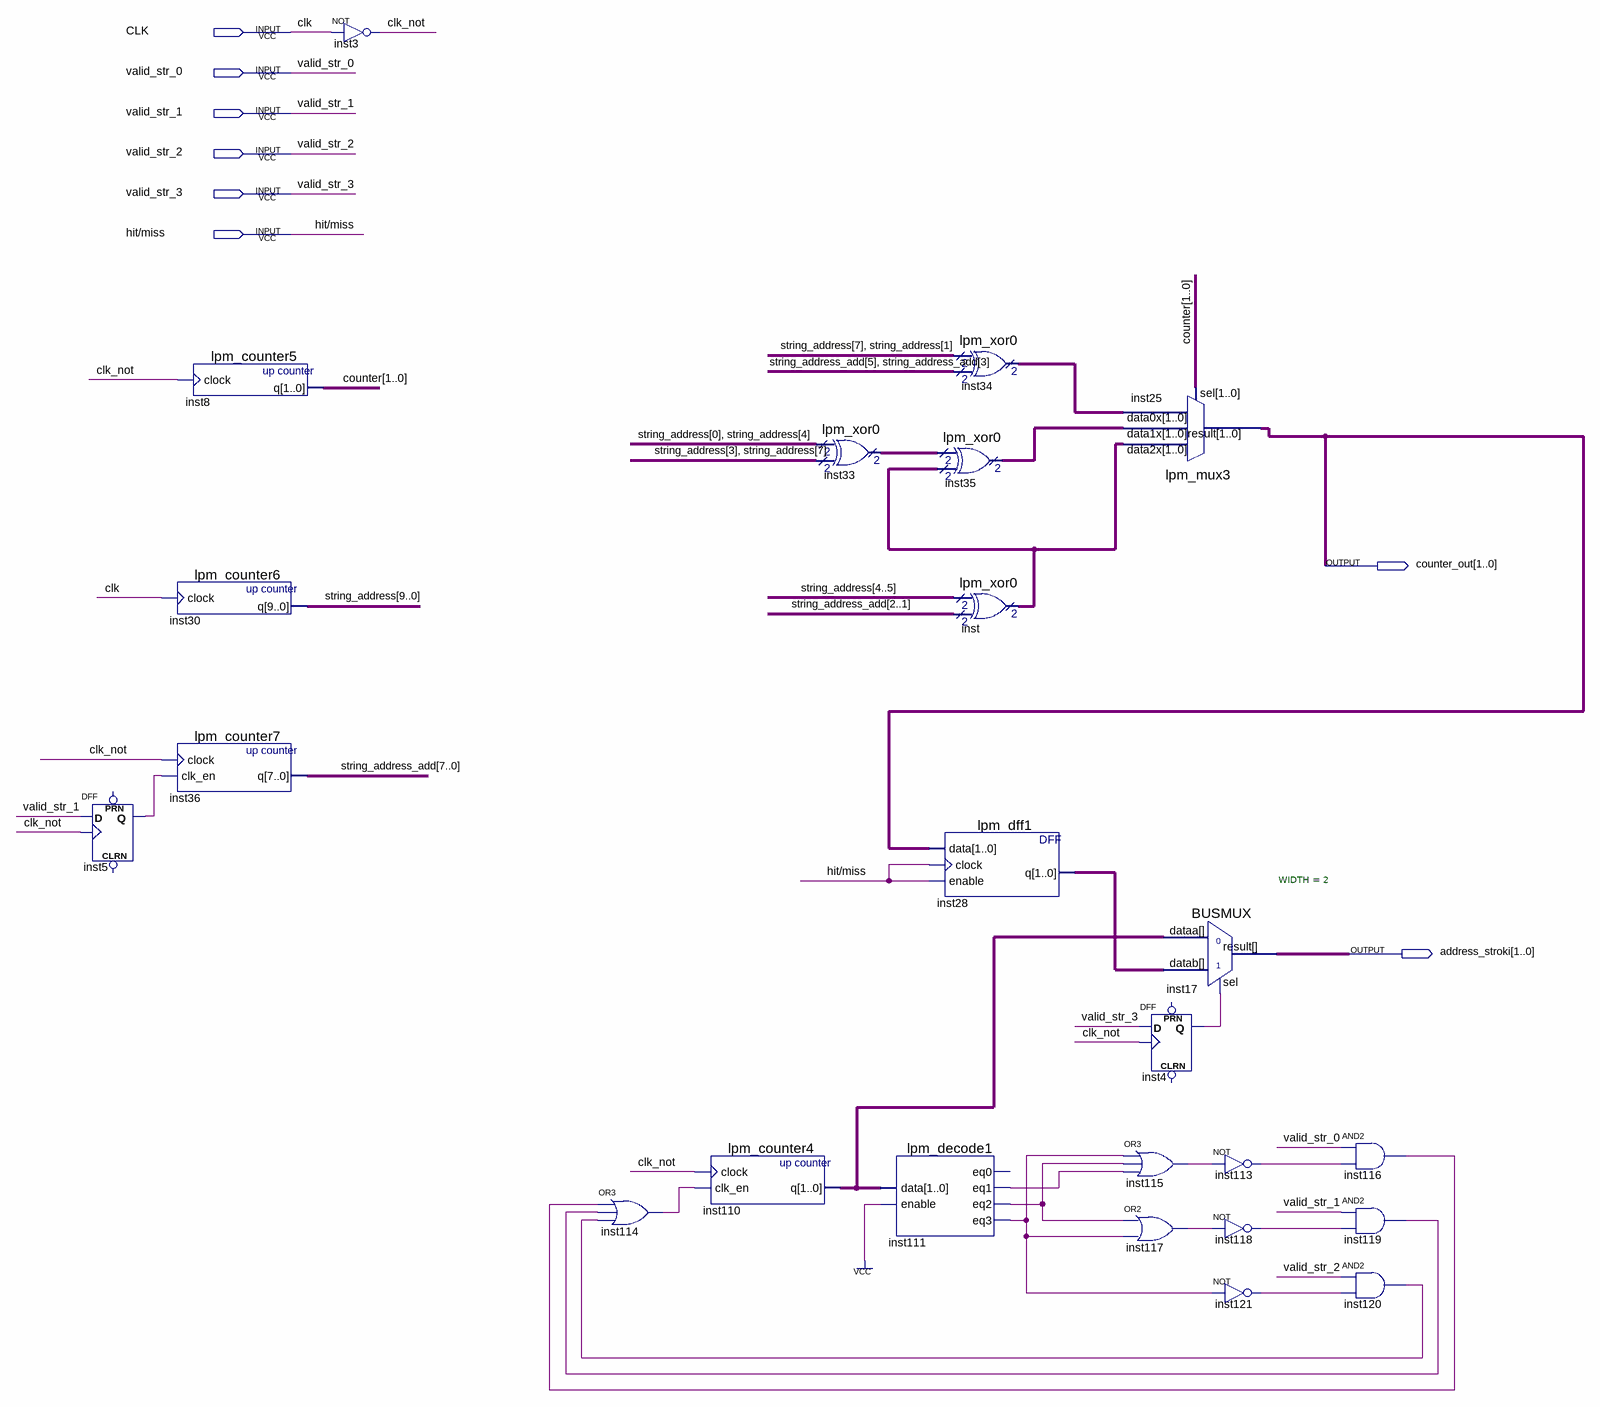
[diagram p0: schematic sheet]
// Quartus schematic Blok_comparing.bdf as structural Verilog: 24 symbols, 8 pins
module Blok_comparing (
  input  CLK,
  input  valid_str_0,
  input  valid_str_1,
  input  valid_str_2,
  input  valid_str_3,
  input  \hit/miss ,
  output [1:0] counter_out,
  output [1:0] address_stroki
);

  wire clk_not, inst4_q, inst5_q, inst111_eq1, inst111_eq2, inst111_eq3, inst113_out, inst114_out,
       inst115_out, inst116_out, inst117_out, inst118_out, inst119_out, inst120_out, inst121_out;
  wire [1:0] counter, inst28_q, inst33_result, inst34_result, inst35_result, inst110_q, inst_result;
  wire [7:0] string_address_add;
  wire [9:0] string_address;

  DFF inst5 (.CLK(clk_not), .D(valid_str_1), .Q(inst5_q));  // open: CLRN, PRN
  lpm_counter5 inst8 (.clock(clk_not), .q(counter));
  lpm_counter6 inst30 (.clock(CLK), .q(string_address));
  lpm_counter7 inst36 (.clock(clk_not), .clk_en(inst5_q), .q(string_address_add));
  not inst3 (clk_not, CLK);
  or inst114 (inst114_out, inst116_out, inst119_out, inst120_out);
  lpm_counter4 inst110 (.clock(clk_not), .clk_en(inst114_out), .q(inst110_q));
  lpm_xor0 inst33 (
    .data0x({string_address[0], string_address[4]}), .data1x({string_address[3], string_address[7]}),
    .result(inst33_result));
  lpm_decode1 inst111 (
    .data(inst110_q), .enable(1'b1), .eq1(inst111_eq1), .eq2(inst111_eq2), .eq3(inst111_eq3));  // open: eq0
  lpm_xor0 inst34 (
    .data0x({string_address[7], string_address[1]}), .data1x({string_address_add[5], string_address_add[3]}),
    .result(inst34_result));
  lpm_xor0 inst35 (.data0x(inst33_result), .data1x(inst_result), .result(inst35_result));
  lpm_xor0 inst (
    .data0x({string_address[4], string_address[5]}), .data1x(string_address_add[2:1]), .result(inst_result));
  lpm_dff1 inst28 (.data(counter_out), .clock(\hit/miss ), .enable(\hit/miss ), .q(inst28_q));
  lpm_mux3 inst25 (
    .data2x(inst_result), .data1x(inst35_result), .data0x(inst34_result), .sel(counter), .result(counter_out));
  BUSMUX #(.WIDTH(2)) inst17 (.datab(inst28_q), .sel(inst4_q), .dataa(inst110_q), .result(address_stroki));
  DFF inst4 (.CLK(clk_not), .D(valid_str_3), .Q(inst4_q));  // open: CLRN, PRN
  or inst115 (inst115_out, inst111_eq3, inst111_eq2, inst111_eq1);
  or inst117 (inst117_out, inst111_eq2, inst111_eq3);
  not inst113 (inst113_out, inst115_out);
  not inst118 (inst118_out, inst117_out);
  not inst121 (inst121_out, inst111_eq3);
  and inst116 (inst116_out, valid_str_0, inst113_out);
  and inst119 (inst119_out, valid_str_1, inst118_out);
  and inst120 (inst120_out, valid_str_2, inst121_out);
endmodule
